# Altium schematic sheet f103disc_sch.SchDoc
size A4
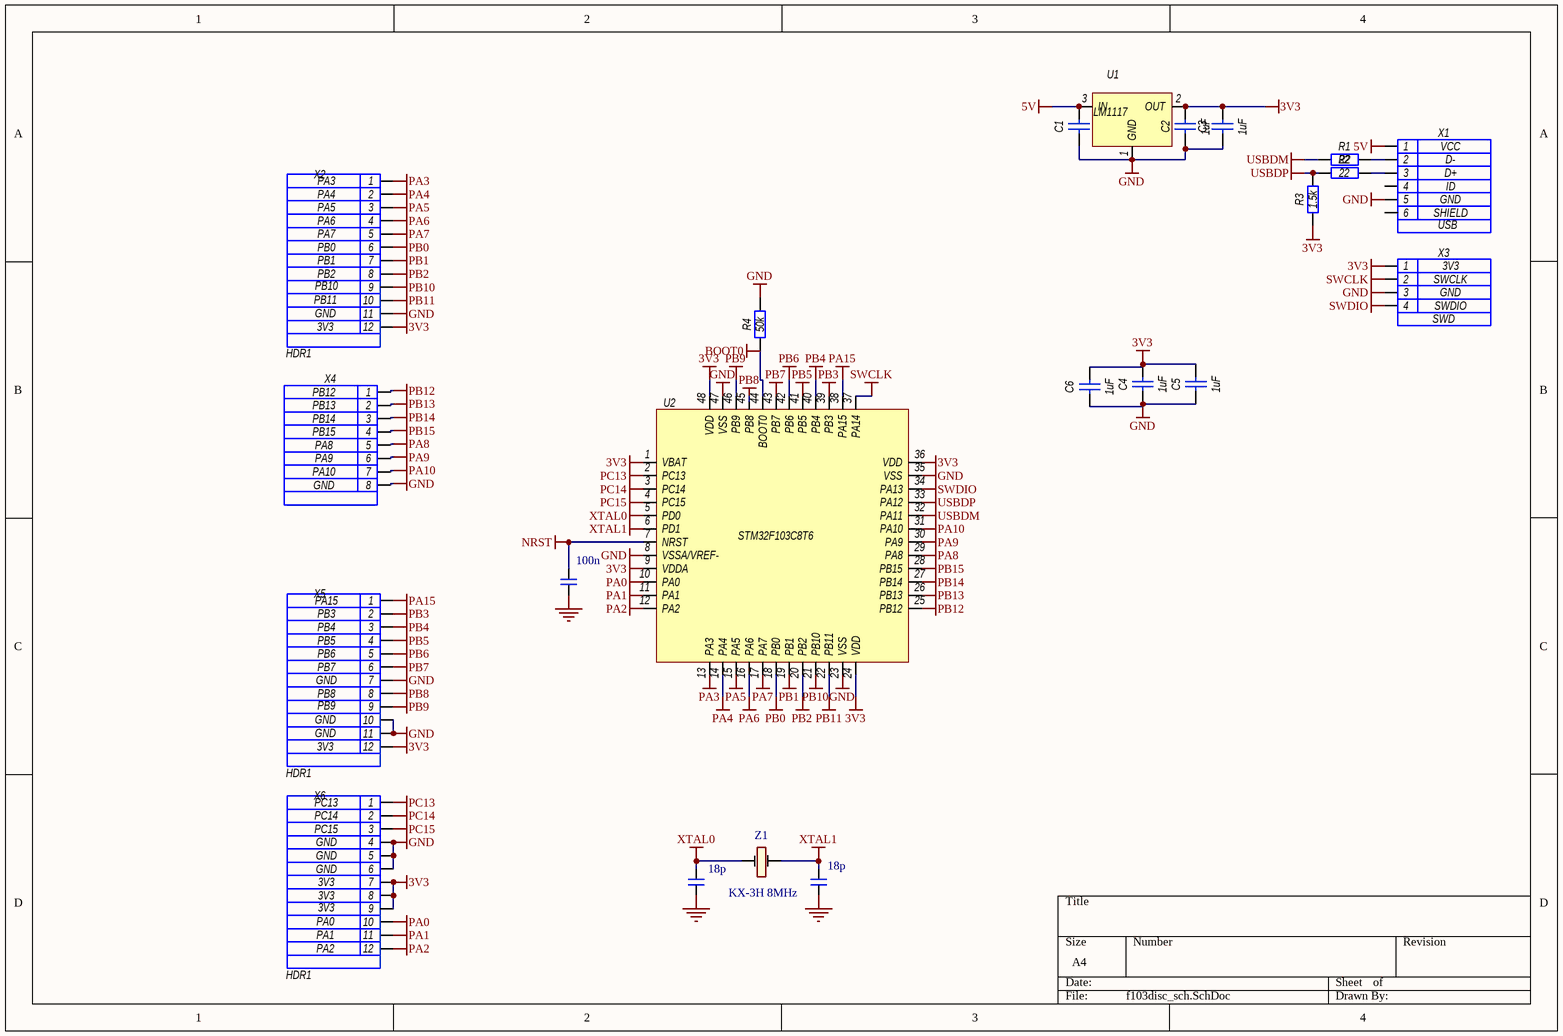
[diagram p0: f103disc_sch.SchDoc]

## Parts
C1  1uF  [CAP_0805]
C2  1uF  [CAP_0805]
C3  1uF  [CAP_0805]
C4  1uF  [CAP_0805]
C5  1uF  [CAP_0805]
C6  1uF  [CAP_0805]
C7  BOM: 100n  [CAP_0603]  (hidden comment: CAP0603)
C8  BOM: 18p  [CAP_0603]  (hidden comment: CAP0603)
C9  BOM: 18p  [CAP_0603]  (hidden comment: CAP0603)
R1  22  [RES_0603]
R2  22  [RES_0603]
R3  1.5k  [RES_0603]
R4  50k  [RES_0603]
U1  LM1117  [SOT223]
U2  STM32F103C8T6  [LQFP48]
X1  Net4: ID  Net1: VCC  Net2: D-  Name: USB  Net3: D+  Net5: GND  Net6: SHIELD  [USB_MINI-B]  (hidden comment: Model)
X2  NET?: HDR1  Net4: PA6  Net1: PA3  Net2: PA4  Net9: PB10  Net3: PA5  Net5: PA7  Net6: PB0  Net7: PB1  Net8: PB2  Net10: PB11  Net11: GND  Net12: 3V3  [PLS-12-3D]  (hidden comment: Model)
X3  Net4: SWDIO  Net1: 3V3  Net2: SWCLK  Net3: GND  [PLS-4-3D]  (hidden comment: SWD)
X4  Net4: PB15  Net1: PB12  Net2: PB13  Net3: PB14  Net5: PA8  Net6: PA9  Net7: PA10  Net8: GND  [PLS-8-3D]  (hidden comment: Model)
X5  NET?: HDR1  Net4: PB5  Net1: PA15  Net2: PB3  Net9: PB9  Net3: PB4  Net5: PB6  Net6: PB7  Net7: GND  Net8: PB8  Net12: 3V3  [PLS-12-3D]  (hidden comment: Model)
X6  NET?: HDR1  Net4: GND  Net1: PC13  Net2: PC14  Net9: 3V3  Net3: PC15  Net10: PA0  Net11: PA1  Net12: PA2  [PLS-12-3D]  (hidden comment: Model)
Z1  BOM: KX-3H 8MHz  [HC49S]  (hidden comment: HC-49S)

## Nets
3V3: C2.2 C3.2 C4.2 C5.2 C6.2 R3.1 U1.2(OUT) U2.1(VBAT) U2.9(VDDA) U2.24(VDD) U2.36(VDD) U2.48(VDD) X2.12 X3.1 X5.12 X6.7 X6.8 X6.9
5V: C1.2 U1.3(IN) X1.1
BOOT0: R4.1 U2.44(BOOT0)
GND: C1.1 C2.1 C3.1 C4.1 C5.1 C6.1 C7.2 C8.2 C9.2 R4.2 U1.1(GND) U2.8(VSSA/VREF-) U2.23(VSS) U2.35(VSS) U2.47(VSS) X1.5 X2.11 X3.3 X4.8 X5.7 X5.10 X5.11 X6.4 X6.5 X6.6
NRST: C7.1 U2.7(NRST)
PA0: U2.10(PA0) X6.10
PA1: U2.11(PA1) X6.11
PA2: U2.12(PA2) X6.12
PA3: U2.13(PA3) X2.1
PA4: U2.14(PA4) X2.2
PA5: U2.15(PA5) X2.3
PA6: U2.16(PA6) X2.4
PA7: U2.17(PA7) X2.5
PA8: U2.29(PA8) X4.5
PA9: U2.30(PA9) X4.6
PA10: U2.31(PA10) X4.7
PA15: U2.38(PA15) X5.1
PB0: U2.18(PB0) X2.6
PB1: U2.19(PB1) X2.7
PB2: U2.20(PB2) X2.8
PB3: U2.39(PB3) X5.2
PB4: U2.40(PB4) X5.3
PB5: U2.41(PB5) X5.4
PB6: U2.42(PB6) X5.5
PB7: U2.43(PB7) X5.6
PB8: U2.45(PB8) X5.8
PB9: U2.46(PB9) X5.9
PB10: U2.21(PB10) X2.9
PB11: U2.22(PB11) X2.10
PB12: U2.25(PB12) X4.1
PB13: U2.26(PB13) X4.2
PB14: U2.27(PB14) X4.3
PB15: U2.28(PB15) X4.4
PC13: U2.2(PC13) X6.1
PC14: U2.3(PC14) X6.2
PC15: U2.4(PC15) X6.3
SWCLK: U2.37(PA14) X3.2
SWDIO: U2.34(PA13) X3.4
USBDM: R1.1 U2.32(PA11)
USBDP: R2.1 R3.2 U2.33(PA12)
XTAL0: C8.1 U2.5(PD0) Z1.1
XTAL1: C9.1 U2.6(PD1) Z1.2
NetR1_2: R1.2 X1.2
NetR2_2: R2.2 X1.3

Not connected (* = marked no-connect by the designer): X1 4 6

## Library data of the parts
C1-C6 = Capacitor: Конденсатор; ValueBOM: 0805 1uF; ValueSCH: 1uF
R1 R2 = Resisitor: Резистор; ValueBOM: 0805 10k 0.125; MarkPCB: 103; ValueSCH: 22
R3 R4 = Resisitor: Резистор; ValueBOM: 0805 47 0.125; MarkPCB: 103
  R3: ValueSCH: 1.5k
  R4: ValueSCH: 50k
U1 = LM1117: Стабилизатор LDO; MarkPCB: xx; ValueBOM: LM1117; ValueSCH: LM1117; HelpURL: C:\Datasheets\.pdf
U2 = STM32F103C8T6: Микроконтроллер; ValueBOM: STM32F103C8T6; ValueSCH: STM32F103C8T6; MarkPCB: STM32F103C8T6; HelpURL: C:\Datasheets\.pdf
X1 = miniUSB connector: коннектор USB; ValueSCH: Model
X2 X5 X6 = Connector 12: ValueSCH: Model
  X5: Net10: GND; Net11: GND
  X6: Net5: GND; Net6: GND; Net7: 3V3; Net8: 3V3
X3 = Connector 4: ValueSCH: SWD; Name: SWD
X4 = Connector 8: ValueSCH: Model